# Altium schematic sheet fpga-bank8.SchDoc: FPGA - Bank 8
size Legal; CheckedBy: J. Brinton; CompanyName: Signal Laboratories, Inc.; DrawnBy: J. Brinton; Engineer: J. Brinton; Address1: 3479 Edison Way; Address2: Menlo Park CA 94025; Address3: +1 (877) 778-8435; Address4: siglabs.com; DocumentNumber: 34; Revision: 2b; SheetNumber: 35; SheetTotal: 58
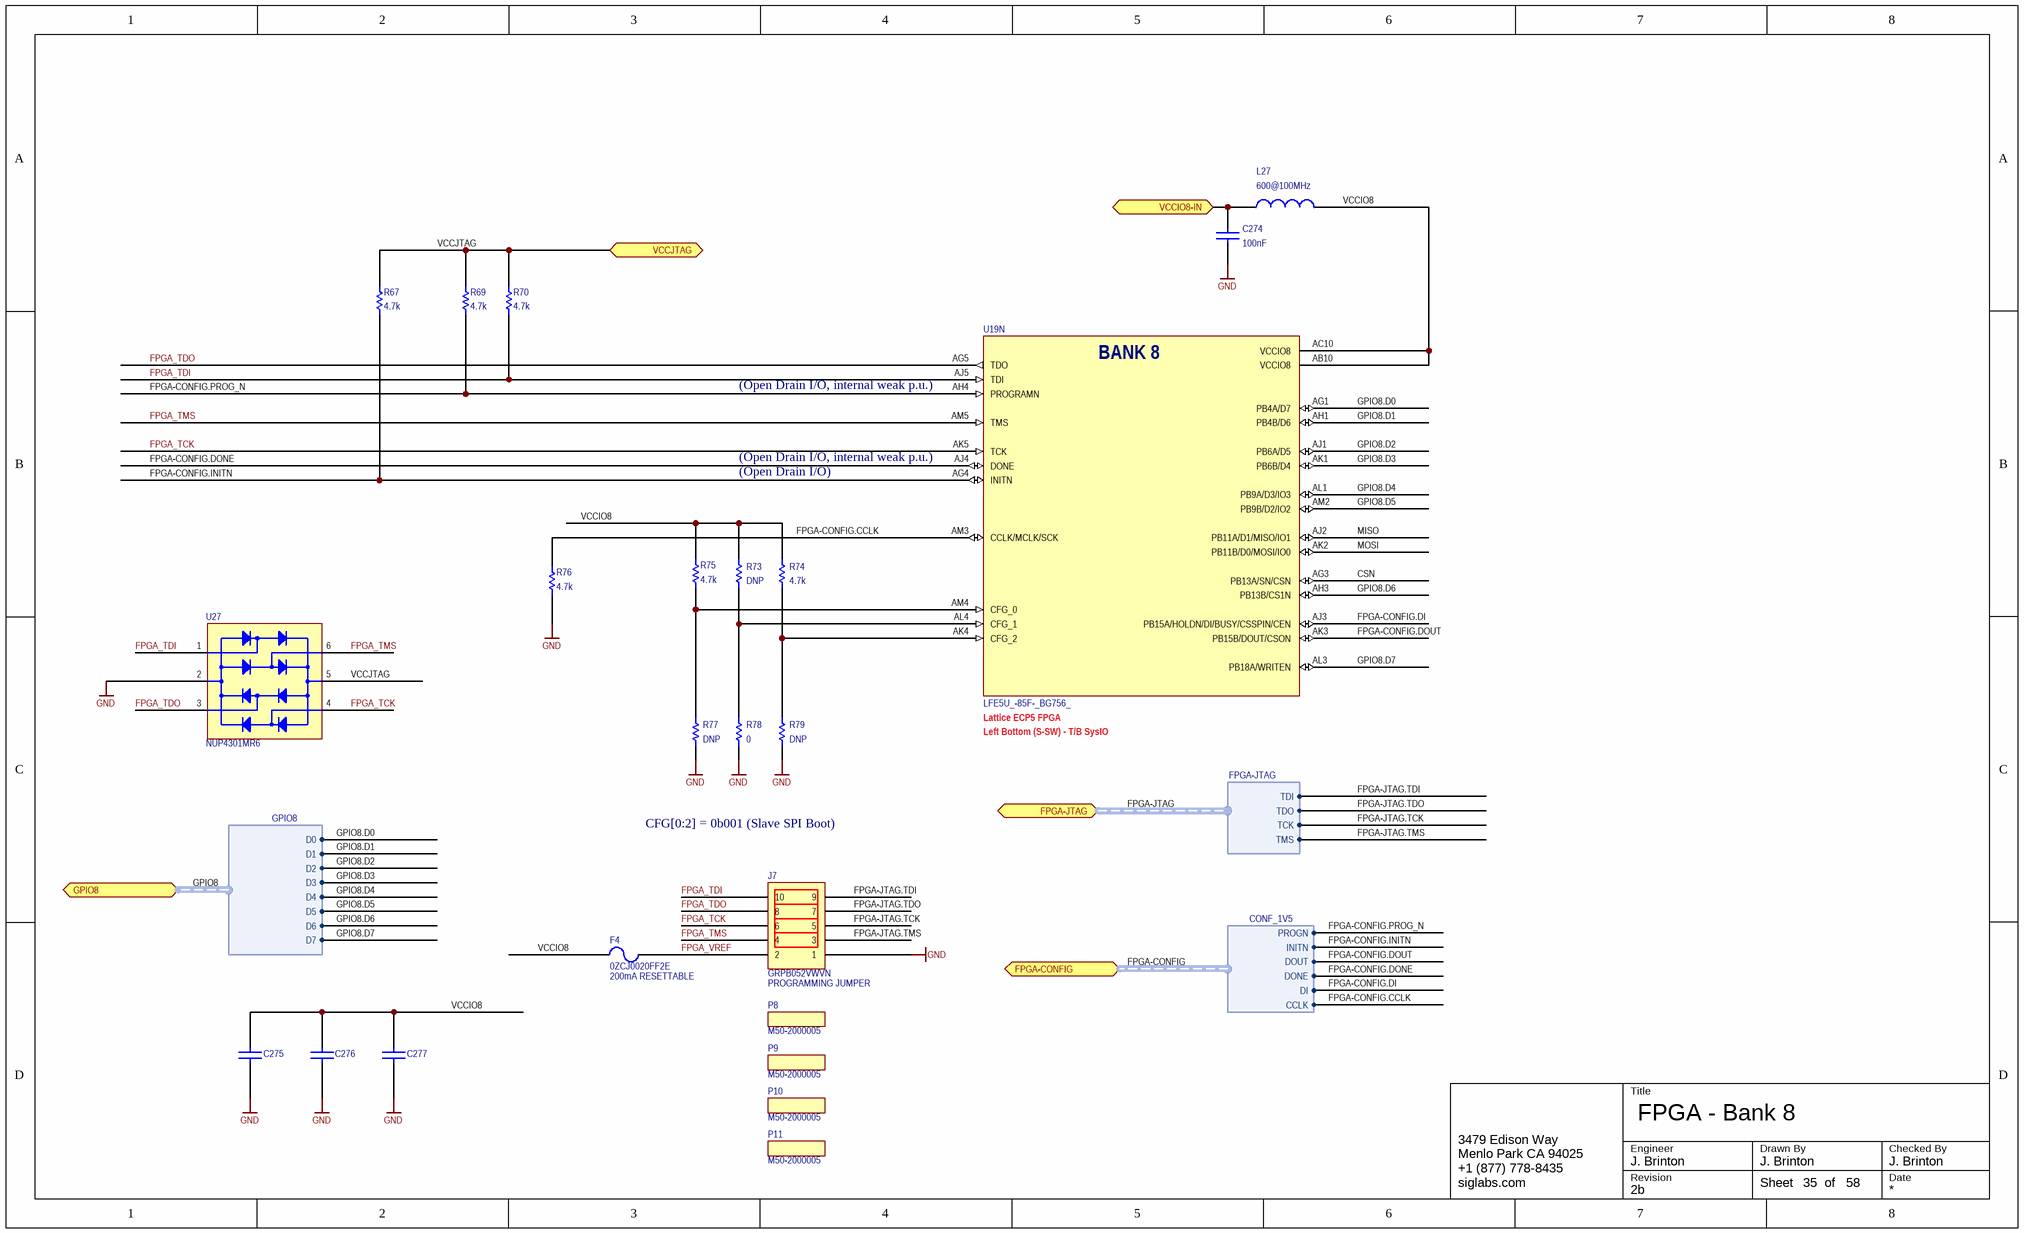
[diagram p0: fpga-bank8.SchDoc]

## Parts
C274  value 100nF  [CAPC1005X56N]  (hidden comment: GRM155R71C104KA88J)
C275  GRM21BR71C225KA12L  [CAPC1608X90N]  (value not drawn)
C276  GRM155R71C104KA88J  [CAPC1005X56N]  (value not drawn)
C277  GRM155R71C104KA88J  [CAPC1005X56N]  (value not drawn)
F4  0ZCJ0020FF2E  [1206]
J7  GRPB052VWVN  [GRPB052VWVN]
L27  value 600@100MHz  [0402]  (hidden comment: BLM15PX601SN1D)
P8  M50-2000005  (mechanical)
P9  M50-2000005  (mechanical)
P10  M50-2000005  (mechanical)
P11  M50-2000005  (mechanical)
R67  value 4.7k  [0603]  (hidden comment: ERJ3EKF4701V)
R69  value 4.7k  [0603]  (hidden comment: ERJ3EKF4701V)
R70  value 4.7k  [0603]  (hidden comment: ERJ3EKF4701V)
R73  Do Not Place: DNP  [0603]  (hidden comment: ERJ3EKF4701V)
R74  value 4.7k  [0603]  (hidden comment: ERJ3EKF4701V)
R75  value 4.7k  [0603]  (hidden comment: ERJ3EKF4701V)
R76  value 4.7k  [0603]  (hidden comment: ERJ3EKF4701V)
R77  Do Not Place: DNP  [0603]  (hidden comment: ERJ-3GEY0R00V)
R78  value 0  [0603]  (hidden comment: ERJ-3GEY0R00V)
R79  Do Not Place: DNP  [0603]  (hidden comment: ERJ-3GEY0R00V)
U19  LFE5U_-85F-_BG756_  [caBGA756]  (part N of 19)
U27  NUP4301MR6  [SOT23-6]

## Ports
FPGA-CONFIG (harness CONF_1V5), FPGA-JTAG (harness FPGA-JTAG), GPIO8 (harness GPIO8), VCCIO8-IN, VCCJTAG

## Harnesses
GPIO8: D0, D1, D2, D3, D4, D5, D6, D7
FPGA-JTAG: TDI, TDO, TCK, TMS
CONF_1V5: CCLK, DI, DONE, DOUT, INITN, PROGN

## Nets
GND: C274.1 C275.1 C276.1 C277.1 J7.1 R76.1 R77.1 R78.1 R79.1 U27.2(VN)
CSN: U19.AG3(PB13A/SN/CSN)
FPGA-CONFIG.CCLK: R76.2 U19.AM3(CCLK/MCLK/SCK) ; port FPGA-CONFIG.CCLK
FPGA-CONFIG.DI: U19.AJ3(PB15A/HOLDN/DI/BUSY/CSSPIN/CEN) ; port FPGA-CONFIG.DI
FPGA-CONFIG.DONE: U19.AJ4(DONE) ; port FPGA-CONFIG.DONE
FPGA-CONFIG.DOUT: U19.AK3(PB15B/DOUT/CSON) ; port FPGA-CONFIG.DOUT
FPGA-CONFIG.INITN: R67.1 U19.AG4(INITN) ; port FPGA-CONFIG.INITN
FPGA-CONFIG.PROG_N: R69.1 U19.AH4(PROGRAMN) ; port FPGA-CONFIG.PROGN
FPGA-JTAG.TCK: J7.5 ; port FPGA-JTAG.TCK
FPGA-JTAG.TDI: J7.9 ; port FPGA-JTAG.TDI
FPGA-JTAG.TDO: J7.7 ; port FPGA-JTAG.TDO
FPGA-JTAG.TMS: J7.3 ; port FPGA-JTAG.TMS
FPGA_TCK: J7.6 U19.AK5(TCK) U27.4(C)
FPGA_TDI: J7.10 R70.1 U19.AJ5(TDI) U27.1(A)
FPGA_TDO: J7.8 U19.AG5(TDO) U27.3(B)
FPGA_TMS: J7.4 U19.AM5(TMS) U27.6(D)
FPGA_VREF: F4.2 J7.2
GPIO8.D0: U19.AG1(PB4A/D7) ; port GPIO8.D0
GPIO8.D1: U19.AH1(PB4B/D6) ; port GPIO8.D1
GPIO8.D2: U19.AJ1(PB6A/D5) ; port GPIO8.D2
GPIO8.D3: U19.AK1(PB6B/D4) ; port GPIO8.D3
GPIO8.D4: U19.AL1(PB9A/D3/IO3) ; port GPIO8.D4
GPIO8.D5: U19.AM2(PB9B/D2/IO2) ; port GPIO8.D5
GPIO8.D6: U19.AH3(PB13B/CS1N) ; port GPIO8.D6
GPIO8.D7: U19.AL3(PB18A/WRITEN) ; port GPIO8.D7
MISO: U19.AJ2(PB11A/D1/MISO/IO1)
MOSI: U19.AK2(PB11B/D0/MOSI/IO0)
VCCIO8: C275.2 C276.2 C277.2 F4.1 L27.1 R73.2 R74.2 R75.2 U19.AB10(VCCIO8) U19.AC10(VCCIO8)
VCCIO8-IN: C274.2 L27.2 ; port VCCIO8-IN
VCCJTAG: R67.2 R69.2 R70.2 U27.5(VP) ; port VCCJTAG
NetR73_1: R73.1 R78.2 U19.AL4(CFG_1)
NetR74_1: R74.1 R79.2 U19.AK4(CFG_2)
NetR75_1: R75.1 R77.2 U19.AM4(CFG_0)

## Buses and harness runs
harness FPGA-CONFIG = port FPGA-CONFIG
harness FPGA-JTAG = port FPGA-JTAG
harness GPIO8 = port GPIO8

## Notes on the sheet
- (near U19) (Open Drain I/O, internal weak p.u.)
- (Open Drain I/O)
- Left Bottom (S-SW) - T/B SysIO
- (near U19) Lattice ECP5 FPGA
- CFG[0:2] = 0b001 (Slave SPI Boot)
- (near F4) 200mA RESETTABLE
- PROGRAMMING JUMPER
- Title
- Engineer
- Revision
- Drawn By
- Checked By
- Date
- Sheet
- of
- (in symbol LFE5U_-85F-_BG756_, part N) BANK 8

## Library data of the parts
C274 C276 C277 = GRM155R71A104KA01J: Ceramic Capacitor 100nF ±10% 16V X7R 0402; Manufacturer: Murata; Tr: -55:125; Manufacturer P/N: GRM155R71C104KA88J; Tolerance: ±10%; Package: 0402; Voltage: 16V
  C276 C277: Value: 100nF
C275 = GRM188R71A225KE15D: Ceramic Capacitor 2.2uF ±10% 10V X7R 0603; Manufacturer: Murata; Value: 2.2µF; Tr: -55:125; Manufacturer P/N: GRM188R71A225KE15D; Tolerance: ±10%; Package: 0603; Voltage: 10V
F4 = 0ZCJ0020FF2E: PTC Resettable Fuse, 0.2A, 30V, SMD 1206; Manufacturer: Bell Fuse; Manufacturer P/N: 0ZCJ0020FF2E; Package: 1206
J7 = GRPB052VWVN: Male Header, 0.050" Pitch, 2x5 Position; Manufacturer: Sullins; Manufacturer P/N: GRPB052VWVN
L27 = IND 0402: Ferrite Bead 600-Ohm @ 100MHz 900mA 0402; Manufacturer: Murata; Tolerance: ±25%; Tr: -55:125; Manufacturer P/N: BLM15PX601SN1D; Package: 0402
P8-P11 = M50-1900005: 1.27mm Jumper Socket; Manufacturer: Harwin; Manufacturer P/N: M50-1900005
R67 R69 R70 R73-R76 = RES 0603 10k 1%: Thick Film Resistor 4.7k ±1% 0603; Manufacturer: Panasonic; Tr: -55:155; Tolerance: ±1%; Manufacturer P/N: ERJ3EKF4701V; Package: 0603
  R73: Value: 4.7k
  R74: Do Not Place: *
R77 R79 = RES 0603 10k 1%: Thick Film Resistor Jumper 0603; Manufacturer: Panasonic; Tolerance: 0; Tr: -55:155; Value: 0; Manufacturer P/N: ERJ-3GEY0R00V; Package: 0603
R78 = RES 0603 10k 1%: Thick Film Resistor Jumper 0603; Manufacturer: Panasonic; Tr: -55:155; Tolerance: 0; Manufacturer P/N: ERJ-3GEY0R00V; Package: 0603
U19 = LFE5U_-85F-_BG756_: ECP5 FPGA, 85k LUT, 756-caBGA; Manufacturer: Lattice Semiconductor; Manufacturer P/N: LFE5U_-85F-_BG756_
U27 = NUP4301MR6: 4-Lane TVS Diode Array; Manufacturer: On Semiconductor; Manufacturer P/N: NUP4301MR6